# EAGLE design TurbochargerController IR (EAGLE 9.6.2)
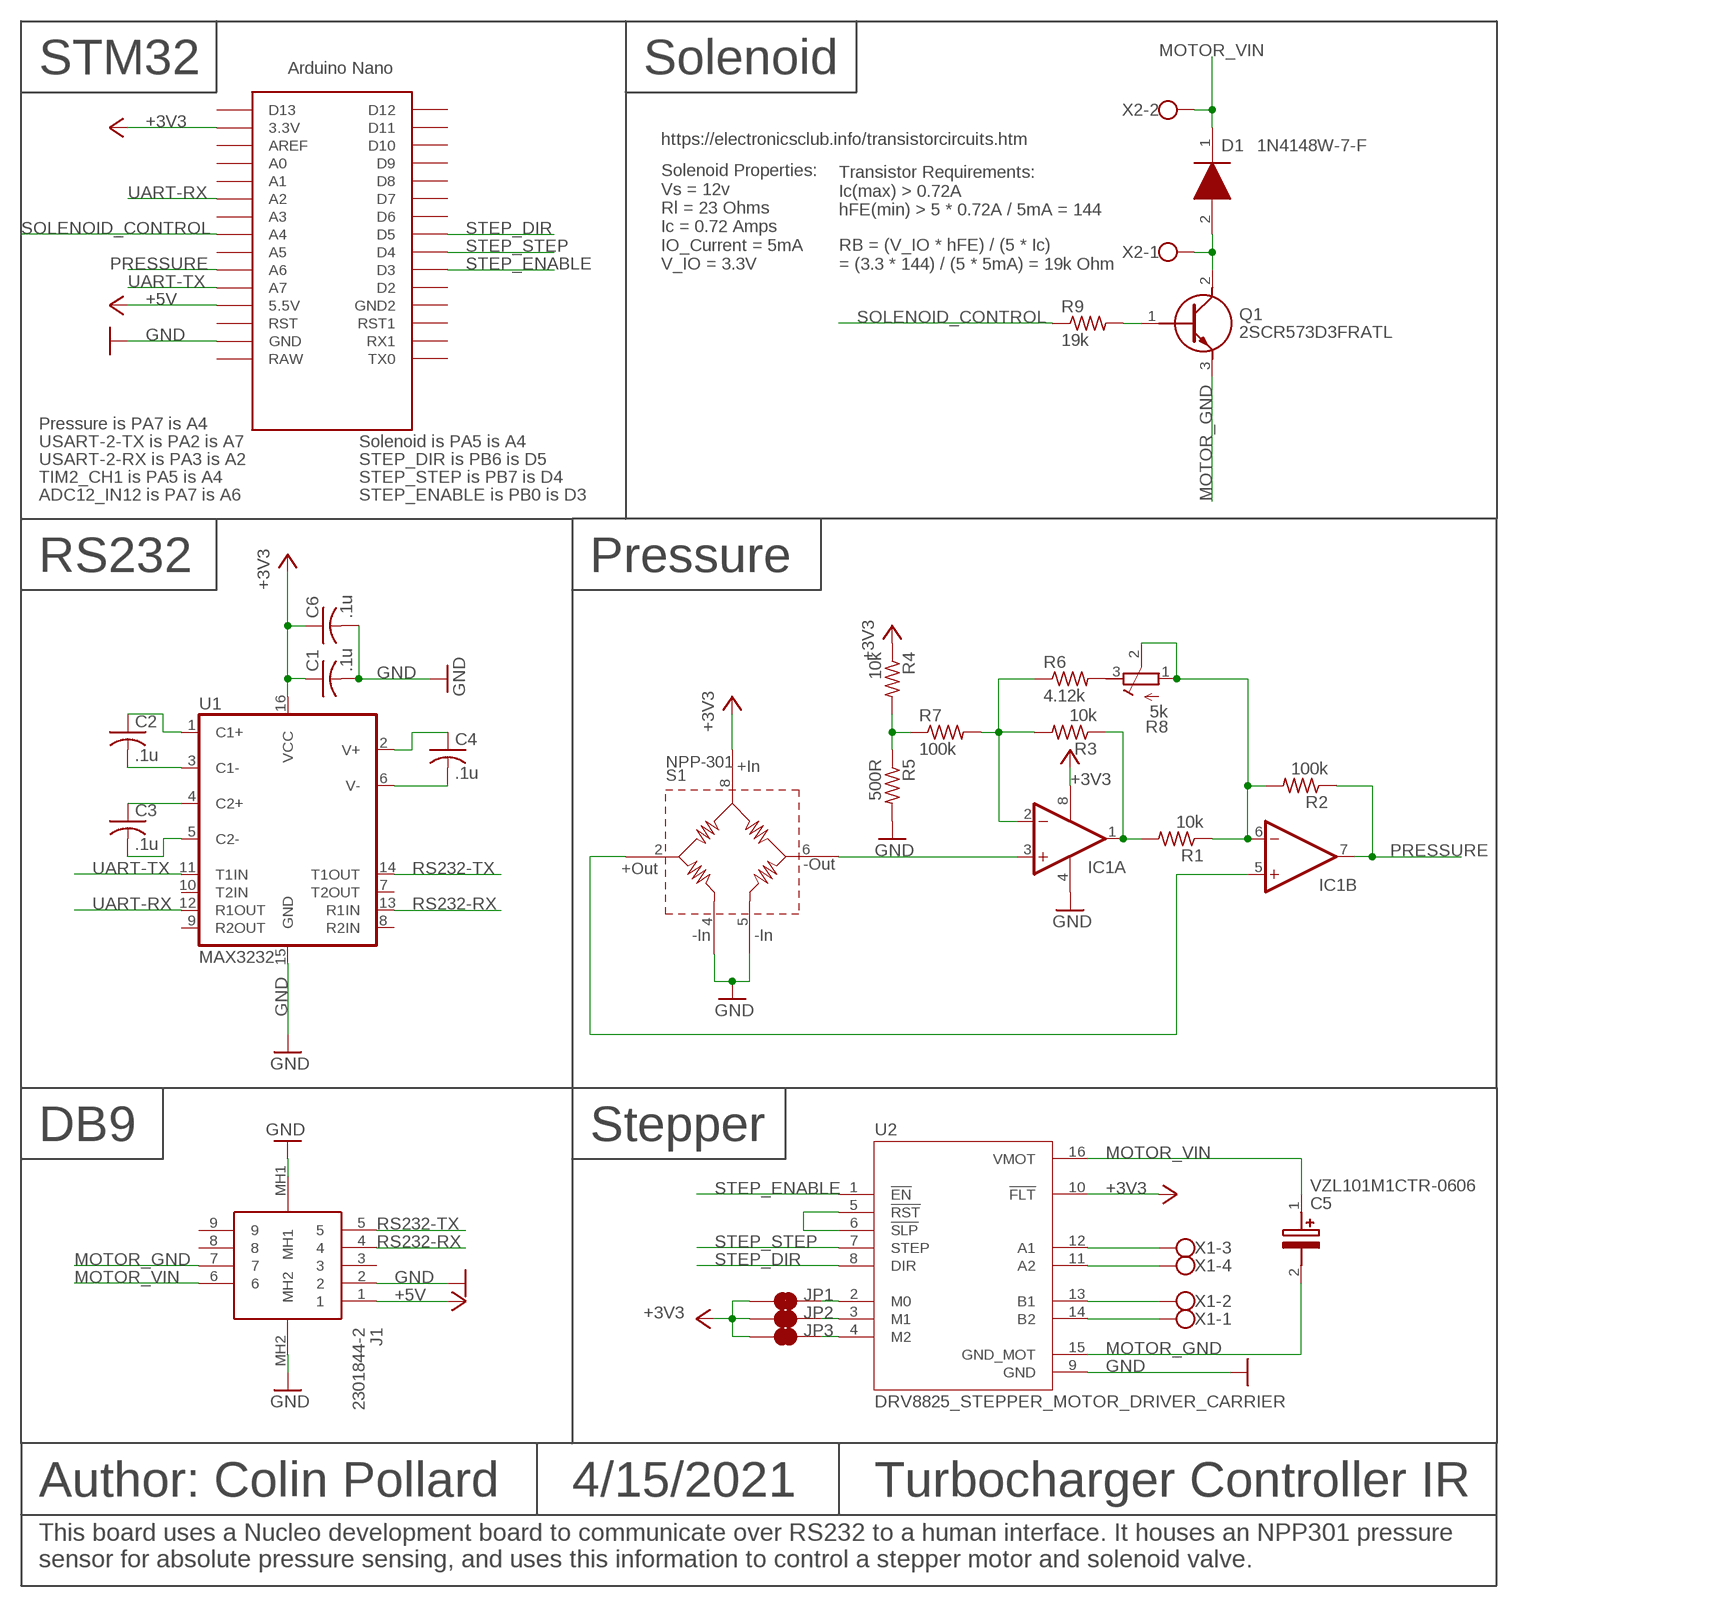
[diagram p0: schematic, sheet 1]

## Parts
C1  .1u  C-USC1206  [C1206]
C2  .1u  C-USC1206  [C1206]
C3  .1u  C-USC1206  [C1206]
C4  .1u  C-USC1206  [C1206]
C5  VZL101M1CTR-0606  [CAPAE660X610N]
C6  .1u  C-USC1206  [C1206]
D1  1N4148W-7-F  [SOD3716X145N]
IC1  TL072D  [SO08]
J1  2301844-2  [23018442]
JP1  JUMPER-SMT_2_NC_TRACE_SILK  [SMT-JUMPER_2_NC_TRACE_SILK]
JP2  JUMPER-SMT_2_NC_TRACE_SILK  [SMT-JUMPER_2_NC_TRACE_SILK]
JP3  JUMPER-SMT_2_NC_TRACE_SILK  [SMT-JUMPER_2_NC_TRACE_SILK]
Q1  2SCR573D3FRATL  [2SCR573D3FRATL]
R1  10k  R-US_R1206  [R1206]
R2  100k  R-US_R1206  [R1206]
R3  10k  R-US_R1206  [R1206]
R4  10k  R-US_R1206  [R1206]
R5  500R  R-US_R1206  [R1206]
R6  4.12k  R-US_R1206  [R1206]
R7  100k  R-US_R1206  [R1206]
R8  5k  R-TRIMM3296W  [RTRIM3296W]
R9  19k  R-US_R1206  [R1206]
S1  NPP-301  [SO08]
U1  MAX3232  MAX2323SOIC16  [SO16]
U2  DRV8825_STEPPER_MOTOR_DRIVER_CARRIER  [IC_DRV8825_STEPPER_MOTOR_DRIVER_CARRIER]
U$1  NANO  [NANO]
X1  W237-4  [W237-4]
X2  W237-102  [W237-102]

## Nets
+3V3: C1.1 C6.1 IC1.8(P:V+) JP1.1 JP2.1 JP3.1 R4.1 S1.8(+IN) U1.16(VCC) U2.10(!FLT) U$1.3.3V
+5V: J1.1 U$1.5V(5.5V)
GND: C1.2 C6.2 IC1.4(P:V-) J1.2 J1.MH1 J1.MH2 R5.2 S1.4(-IN_1) S1.5(-IN_2) U1.15(GND) U2.9(GND) U$1.GND
MOTOR_GND: C5.2(-) J1.7 Q1.3(E) U2.15(GND_MOT)
MOTOR_VIN: C5.1(+) D1.1(K) J1.6 U2.16(VMOT) X2.2
N$1: C3.1 U1.4(C2+)
N$2: C3.2 U1.5(C2-)
N$3: C2.1 U1.1(C1+)
N$4: C2.2 U1.3(C1-)
N$5: C4.2 U1.6(V-)
N$6: C4.1 U1.2(V+)
N$7: IC1.5(B:+IN) S1.2(+OUT)
N$8: IC1.1(A:OUT) R1.2 R3.1
N$9: U2.12(A1) X1.3
N$11: IC1.2(A:-IN) R3.2 R6.1 R7.2
N$12: IC1.3(A:+IN) S1.6(-OUT)
N$13: R6.2 R8.3(E)
N$14: IC1.6(B:-IN) R1.1 R2.2 R8.1(A) R8.2(S)
N$15: R4.2 R5.1 R7.1
N$16: U2.11(A2) X1.4
N$17: U2.13(B1) X1.2
N$18: U2.14(B2) X1.1
N$19: U2.5(!RST) U2.6(!SLP)
N$20: Q1.1(B) R9.2
N$21: D1.2(A) Q1.2(C) X2.1
N$22: JP3.2 U2.4(M2)
N$23: JP2.2 U2.3(M1)
N$24: JP1.2 U2.2(M0)
PRESSURE: IC1.7(B:OUT) R2.1 U$1.A6
RS232-RX: J1.4 U1.13(R1IN)
RS232-TX: J1.5 U1.14(T1OUT)
SOLENOID_CONTROL: R9.1 U$1.A4
STEP_DIR: U2.8(DIR) U$1.D5
STEP_ENABLE: U2.1(!EN) U$1.D3
STEP_STEP: U2.7(STEP) U$1.D4
UART-RX: U1.12(R1OUT) U$1.A2
UART-TX: U1.11(T1IN) U$1.A7
Unconnected: J1.3 J1.8 J1.9 U1.7(T2OUT) U1.8(R2IN) U1.9(R2OUT) U1.10(T2IN) U$1.A0 U$1.A1 U$1.A3 U$1.A5 U$1.AREF U$1.D2 U$1.D6 U$1.D7 U$1.D8 U$1.D9 U$1.D10 U$1.D11 U$1.D12 U$1.D13 U$1.GND1(GND2) U$1.ICSP1 U$1.ICSP2 U$1.ICSP3 U$1.ICSP4 U$1.ICSP5 U$1.ICSP6 U$1.RAW U$1.RST U$1.RST1 U$1.RX1 U$1.TX0

## Notes on the sheet
- STM32 | Solenoid
- https://electronicsclub.info/transistorcircuits.htm
- Transistor Requirements:
  Ic(max) > 0.72A
  hFE(min) > 5 * 0.72A / 5mA = 144
- Solenoid Properties:
  Vs = 12v
  Rl = 23 Ohms
  Ic = 0.72 Amps
  IO_Current = 5mA
  V_IO = 3.3V
- RB = (V_IO * hFE) / (5 * Ic) 
  = (3.3 * 144) / (5 * 5mA) = 19k Ohm
- Pressure is PA7 is A4
- USART-2-TX is PA2 is A7 | Solenoid is PA5 is A4
- USART-2-RX is PA3 is A2 | STEP_DIR is PB6 is D5
- TIM2_CH1 is PA5 is A4 | STEP_STEP is PB7 is D4
- ADC12_IN12 is PA7 is A6 | STEP_ENABLE is PB0 is D3
- RS232 | Pressure
- DB9 | Stepper
- Author: Colin Pollard | 4/15/2021 | Turbocharger Controller IR
- This board uses a Nucleo development board to communicate over RS232 to a human interface. It houses an NPP301 pressure 
  sensor for absolute pressure sensing, and uses this information to control a stepper motor and solenoid valve.

## Library data of the parts
C1-C4 C6 = rcl:C-US: CAPACITOR, American symbol; SPICEPREFIX: C
C5 = SamacSys_Parts:VZL101M1CTR-0606: Aluminum Electrolytic Capacitors - SMD 100uF 16 Volts 20% Source: Datasheet; DESCRIPTION: Aluminum Electrolytic Capacitors - SMD 100uF 16 Volts 20%; HEIGHT: 6.1mm; MANUFACTURER_NAME: Lelon; MANUFACTURER_PART_NUMBER: VZL101M1CTR-0606; MOUSER_PART_NUMBER: 140-VZL101M1CTR-0606; MOUSER_PRICE-STOCK: https://www.mouser.co.uk/ProductDetail/Lelon/VZL101M1CTR-0606?qs=AQlKX63v8RtJERxnS%252BVhgg%3D%3D
D1 = SamacSys_Parts:1N4148W-7-F: Diode Switching 150mA 100V 400mW SOD123 Diodes Inc 1N4148W-7-F Switching Diode 100V, 2-Pin SOD-123 Source: Datasheet <https://componentsearchengine.com/Datasheets/2/1N4148W-7-F.pdf>; DESCRIPTION: Diode Switching 150mA 100V 400mW SOD123 Diodes Inc 1N4148W-7-F Switching Diode 100V, 2-Pin SOD-123; HEIGHT: 1.45mm; MANUFACTURER_NAME: Diodes Inc.; MANUFACTURER_PART_NUMBER: 1N4148W-7-F; MOUSER_PART_NUMBER: 621-1N4148W-F; MOUSER_PRICE-STOCK: https://www.mouser.co.uk/ProductDetail/Diodes-Incorporated/1N4148W-7-F/?qs=LHX0FizJzg7Ae9ZM8LTAWw%3D%3D
IC1 = linear:TL072: OP AMP
J1 = SamacSys_Parts:2301844-2: TE CONNECTIVITY - 2301844-2 - D-SUB CONN, RCPT, 9POS, THROUGH HOLE Source: Datasheet <https://www.te.com/commerce/DocumentDelivery/DDEController?Action=showdoc&DocId=Customer Drawing2301844HpdfEnglishENG_CD_2301844_H.pdf2301844-2>; DESCRIPTION: TE CONNECTIVITY - 2301844-2 - D-SUB CONN, RCPT, 9POS, THROUGH HOLE; HEIGHT: 13.955mm; MANUFACTURER_NAME: TE Connectivity; MANUFACTURER_PART_NUMBER: 2301844-2; MOUSER_PART_NUMBER: 571-2301844-2; MOUSER_PRICE-STOCK: https://www.mouser.co.uk/ProductDetail/TE-Connectivity/2301844-2?qs=qSfuJ%252Bfl%2Fd438cnhtfFtiA%3D%3D
JP1-JP3 = SparkFun-Jumpers:JUMPER-SMT_2_NC_TRACE: Normally closed trace jumper This jumper has a trace between two pads so it's normally closed (NC). Use a razor knife to open the connection. For best results follow the IPC guidelines for cutting traces: Cutout at least 0.063 mm (0.005 in). Remove all loose material to clean up the cut area. Seal the cut with an approved epoxy. Reapply solder to reclose the connection.
Q1 = SamacSys_Parts:2SCR573D3FRATL: Bipolar Transistors - BJT NPN 50V 3A 10W TO-252(DPAK) Source: Datasheet <https://componentsearchengine.com/Datasheets/2/2SCR573D3FRATL.pdf>; DESCRIPTION: Bipolar Transistors - BJT NPN 50V 3A 10W TO-252(DPAK); HEIGHT: 2.3mm; MANUFACTURER_NAME: ROHM Semiconductor; MANUFACTURER_PART_NUMBER: 2SCR573D3FRATL; MOUSER_PART_NUMBER: 755-2SCR573D3FRATL; MOUSER_PRICE-STOCK: https://www.mouser.co.uk/ProductDetail/ROHM-Semiconductor/2SCR573D3FRATL?qs=qSfuJ%252Bfl%2Fd7Zix33eyvwHw%3D%3D
R1-R7 R9 = rcl:R-US_: RESISTOR, American symbol; SPICEPREFIX: R
R8 = rcl:R-TRIMM: Trimm resistor; SPICEMODEL: X; SPICEPREFIXL: POT
S1 = NPP-301:NPP-301
U1 = SparkFun-IC-Comms:MAX2323: RS232 Transceiver This part covers 232 drivers that are compatible with the MAX3232. Sipex SP3232EB Datasheet <http://cdn.sparkfun.com/datasheets/Components/General%20IC/SP3232EBCA-L.pdf> SparkFun Products SOIC component <https://www.sparkfun.com/products/589> (COM-00589 / IC-08171) Retired DIP component (COM-00316 / IC-08446) SparkFun Transceiver Breakout - MAX3232 <https://www.sparkfun.com/products/11189> (BOB-11189) SparkFun XBee Explorer Serial <https://www.sparkfun.com/products/13225> (WRL-13225); PROD_ID: IC-08171
U2 = DRV8825_STEPPER_MOTOR_DRIVER_CARRIER:DRV8825_STEPPER_MOTOR_DRIVER_CARRIER: Stepper motor controler; IC: DRV8825; 1.5A; Uin mot: 8.2÷45V; AVAILABILITY: Unavailable; DESCRIPTION: Stepper, Bipolar 8.2 ~ 45VDC Supply 1.5A 8.2 ~ 45V Load; MF: Pololu; MP: DRV8825 STEPPER MOTOR DRIVER CARRIER; PACKAGE: None; PRICE: None
U$1 = Arduino-clone:NANO: Arduino Nano
X1 = con-wago-500:W237-4: WAGO SCREW CLAMP; OC_FARNELL: unknown; OC_NEWARK: unknown
X2 = con-wago-500:W237-102: WAGO SCREW CLAMP; MPN: 237-102; OC_FARNELL: unknown; OC_NEWARK: 70K9898

## Board
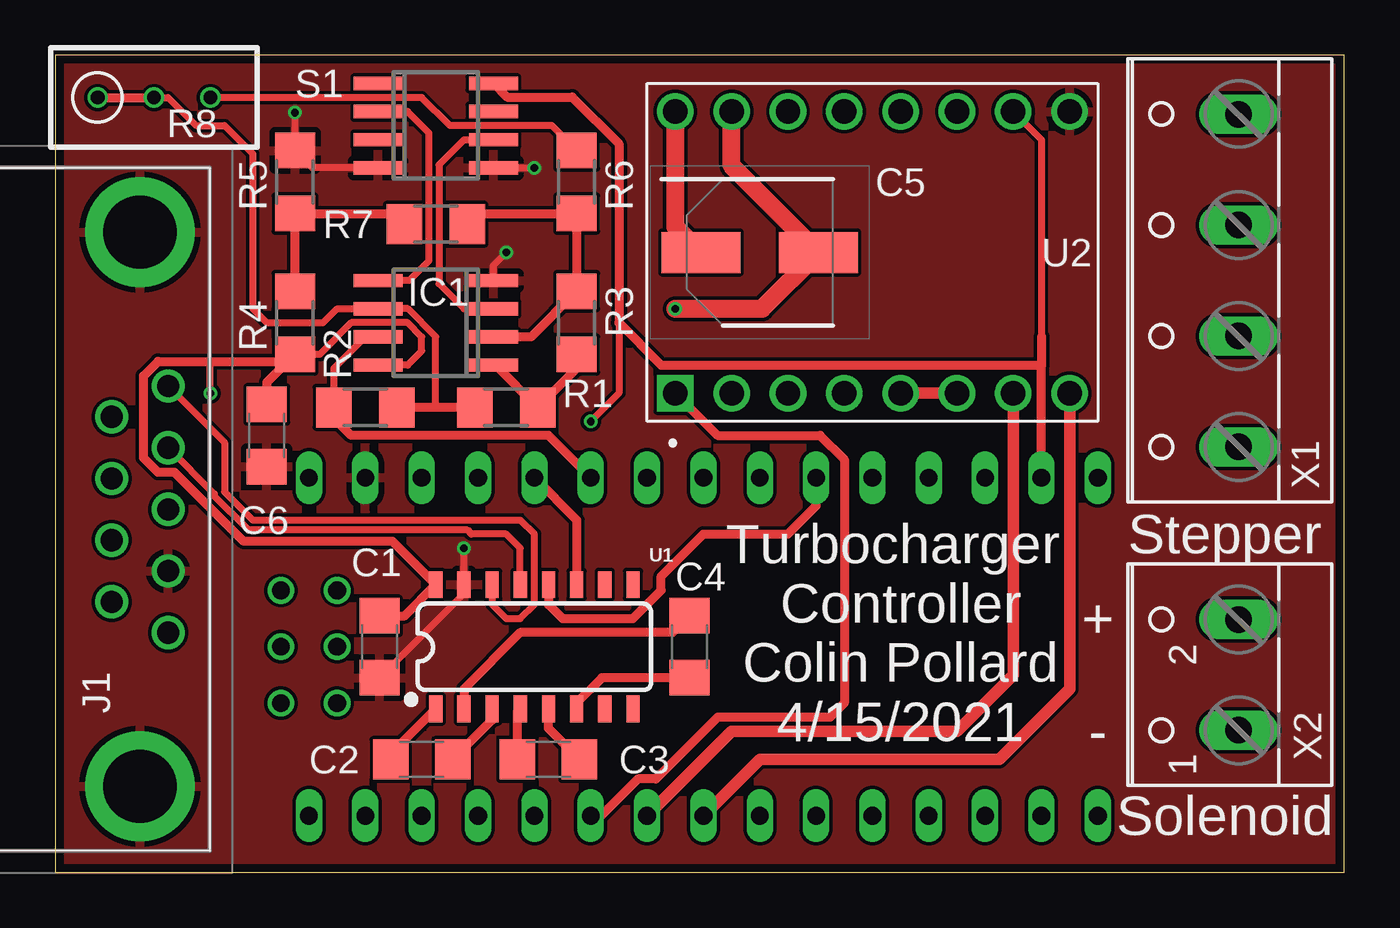
[diagram p1: board, top side]
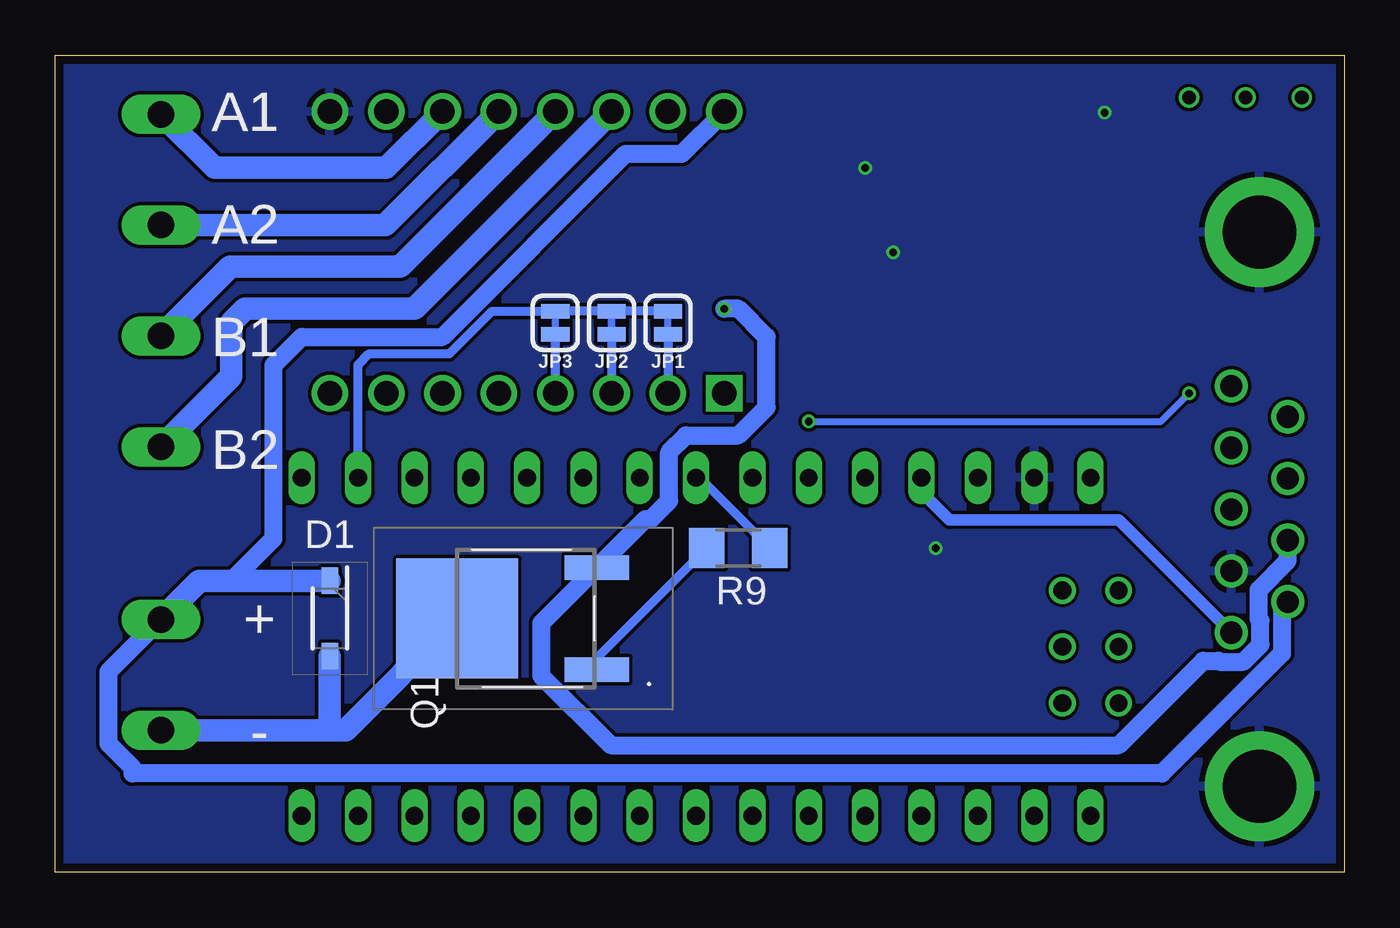
[diagram p2: board, bottom side, seen from below]

Size 58.09 x 36.82 mm. Coordinates in mm from the lower left corner, seen from the top.
Outline: 0,0 58.09,0 58.09,36.82 0,36.82 0,0
Copper layers (1*16): Top 0.035559375mm / dielectric 1.6mm / Bottom 0.035559375mm
Design rules "OSH DRC": minimum track width 6mil, minimum drill 10mil, track to track 6mil, track to pad 6mil, pad to pad 6mil, via to via 6mil, smd to smd 6mil, copper to edge 15mil, drill to drill 6mil, minimum pad ring 5mil, minimum via ring 5mil, stop-mask expansion 2.5mil, vias tented up to drill 0mil, thermal gap 10mil

### Footprints (pad centres in the part's own frame; a part is rotated, then mirrored left to right if it is on the bottom)
C1206 = smd 1.6 x 1.8: 1 -1.4,0; 2 1.4,0
CAPAE660X610N = smd 3.55 x 1.85: 1 -2.65,0; 2 2.65,0
SOD3716X145N = smd 1.2 x 0.75: 1 -1.7,0; 2 1.7,0
SO08 = smd 0.6 x 2.2: 1 -1.905,-2.6; 2 -0.635,-2.6; 3 0.635,-2.6; 4 1.905,-2.6; 5 1.905,2.6; 6 0.635,2.6; 7 -0.635,2.6; 8 -1.905,2.6
23018442 = drill 1 pad 1.5: 1 0,0; 2 -2.78,0; 3 -5.56,0; 4 -8.34,0; 5 -11.12,0; 6 -1.39,-2.54; 7 -4.17,-2.54; 8 -6.95,-2.54; 9 -9.73,-2.54 | drill 3.3 pad 4.95: MH1 -18.055,-1.27; MH2 6.935,-1.27
SMT-JUMPER_2_NC_TRACE_SILK = smd 0.66 x 1.27: 1 -0.521,0; 2 0.521,0
2SCR573D3FRATL = smd 1.1 x 2.9: 1 -2.3,-3.15; 3 2.3,-3.15 | smd 5.4 x 5.5: 2 0,3.15
R1206 = smd 1.6 x 1.803: 1 -1.422,0; 2 1.422,0
RTRIM3296W = drill 0.61: 1 0,-2.54; 2 0,0; 3 0,2.54
SO16 = smd 0.6 x 1.2: 1 -4.445,-2.8; 2 -3.175,-2.8; 3 -1.905,-2.8; 4 -0.635,-2.8; 5 0.635,-2.8; 6 1.905,-2.8; 7 3.175,-2.8; 8 4.445,-2.8; 9 4.445,2.8; 10 3.175,2.8; 11 1.905,2.8; 12 0.635,2.8; 13 -0.635,2.8; 14 -1.905,2.8; 15 -3.175,2.8; 16 -4.445,2.8
IC_DRV8825_STEPPER_MOTOR_DRIVER_CARRIER = drill 1.1 square: 1 -6.35,8.89 | drill 1.1: 2 -6.35,6.35; 3 -6.35,3.81; 4 -6.35,1.27; 5 -6.35,-1.27; 6 -6.35,-3.81; 7 -6.35,-6.35; 8 -6.35,-8.89; 9 6.35,-8.89; 10 6.35,-6.35; 11 6.35,-3.81; 12 6.35,-1.27; 13 6.35,1.27; 14 6.35,3.81; 15 6.35,6.35; 16 6.35,8.89
NANO = drill 0.8 long: 3.3V -10.16,24.13; 5V -10.16,-1.27; A0 -10.16,19.05; A1 -10.16,16.51; A2 -10.16,13.97; A3 -10.16,11.43; A4 -10.16,8.89; A5 -10.16,6.35; A6 -10.16,3.81; A7 -10.16,1.27; AREF -10.16,21.59; D2 5.08,1.27; D3 5.08,3.81; D4 5.08,6.35; D5 5.08,8.89; D6 5.08,11.43; D7 5.08,13.97; D8 5.08,16.51; D9 5.08,19.05; D10 5.08,21.59; D11 5.08,24.13; D12 5.08,26.67; D13 -10.16,26.67; GND -10.16,-6.35; GND1 5.08,-1.27; RAW -10.16,-8.89; RST -10.16,-3.81; RST1 5.08,-3.81; RX1 5.08,-6.35; TX0 5.08,-8.89 | drill 0.8: ICSP1 -5.08,-10.16; ICSP2 -5.08,-7.62; ICSP3 -2.54,-10.16; ICSP4 -2.54,-7.62; ICSP5 0,-10.16; ICSP6 0,-7.62
W237-4 = drill 1.194 long: 1 -7.5,-1.27; 2 -2.5,-1.27; 3 2.5,-1.27; 4 7.5,-1.27
W237-102 = drill 1.194 long: 1 -2.5,-1.27; 2 2.5,-1.27

### Placement (x,y rotation side)
C1  14.61,10.16 270 top
C2  16.51,5.08 0 top
C3  22.23,5.08 0 top
C4  28.57,10.16 270 top
C5  31.75,27.94 0 top
C6  9.53,19.68 270 top
D1  45.72,11.43 270 bottom
IC1  17.14,24.77 90 top
J1  5.08,10.79 270 top
JP1  30.48,24.77 270 bottom
JP2  33.02,24.77 270 bottom
JP3  35.56,24.77 270 bottom
Q1  36.83,11.43 90 bottom
R1  20.32,20.95 0 top
R2  13.97,20.95 0 top
R3  23.5,24.77 90 top
R4  10.79,24.77 90 top
R5  10.79,31.11 90 top
R6  23.5,31.11 90 top
R7  17.14,29.21 0 top
R8  4.45,34.92 270 top
R9  27.3,14.61 180 bottom
S1  17.14,33.66 270 top
U1  21.59,10.16 0 top
U2  36.83,27.94 90 top
U$1  20.32,7.62 270 top
X1  52.07,26.67 90 top
X2  52.07,8.89 90 top

### Tracks (layer width: path | path; a pad name or v marks a point on that pad's centre or on a via)
+3V3  (via drill 0.35)
  Top 0.305: R4.1 11.91,23.34 13.34,24.77 15.88,24.77 16.51,24.13 16.51,23.5 15.88,22.86 IC1.8 | U2.10 44.45,33.02 44.45,24.13 | 25.4,24.77 25.4,21.59 v24.13,20.32 | v6.99,21.59 6.99,23.02
  Top 0.406: U$1.3.3V 44.45,22.86 | 44.45,24.13 44.45,22.86 | C1.1 15.74,11.56 U1.16 15.2,14.91 8.49,14.91 5.38,18.02 4.62,18.02 3.97,18.68 3.97,22.38 4.62,23.02 6.99,23.02 10.48,23.02 R4.1 9.53,22.07 C6.1 | S1.8 20.36,34.95 23.29,34.95 25.4,32.84 25.4,24.77 27.3,22.86 44.45,22.86
  Bottom 0.305: v24.13,20.32 8.26,20.32 v6.99,21.59
  Bottom 0.406: JP1.1 JP2.1 JP3.1 38.41,25.29 40.32,23.37 43.94,23.37 44.45,22.86 U$1.3.3V
+5V
  Bottom 0.508: J1.1 10.16,15.88 17.78,15.88 19.05,17.14 U$1.5V
GND  (via drill 0.35)
  Top 0.305: S1.4 11.58,31.75 R5.2 v10.79,34.24 | S1.5 v21.59,31.75 | IC1.4 19.75,27.36 v20.32,27.94 | C1.2 18.41,12.57 U1.15 v18.41,14.61
  pour Top: 0,36.83 57.78,36.83 57.78,0 0,0
  pour Bottom: 0,36.83 57.78,36.83 57.78,0 0,0
MOTOR_GND  (via drill 0.35)
  Top 0.813: U2.15 30.48,31.86 C5.2 31.86,25.4 v27.94,25.4
  Bottom 0.813: J1.7 2.54,14.04 3.85,12.73 3.85,11.42 3.77,11.34 3.77,10.25 4.54,9.48 5.62,9.48 5.67,9.53 6.35,9.53 10.16,5.71 33.05,5.71 36.2,8.86 36.2,11.21 Q1.3 31.5,15.91 31.25,15.91 30.42,16.74 30.42,18.94 29.67,19.68 27.3,19.68 26.04,20.95 26.04,24.13 27.3,25.4 v27.94,25.4
MOTOR_VIN
  Top 0.813: U2.16 27.94,29.1 C5.1
  Bottom 0.813: 50.16,13.13 48.26,15.04 48.26,22.86 46.99,24.13 40.64,24.13 32.38,32.38 29.84,32.38 U2.16 | X2.2 55.69,9.04 55.69,5.79 54.61,4.71 54.61,4.45 8.21,4.45 2.8,9.85 2.8,11.92 J1.6
  Bottom 1.016: D1.1 50.16,13.13 51.6,13.13 X2.2
N$1
  Top 0.406: C3.1 20.82,7.23 U1.4
N$2
  Top 0.406: C3.2 22.23,6.48 U1.5
N$3
  Top 0.406: U1.1 15.11,5.33 C2.1
N$4
  Top 0.406: C2.2 19.68,6.86 U1.3
N$5
  Top 0.406: C4.2 24.64,8.76 23.5,7.62 U1.6
N$6
  Top 0.406: C4.1 27.81,10.79 20.95,10.79 18.41,8.26 U1.2
N$7
  Top 0.305: S1.2 15.88,34.29 16.83,33.34 16.83,27.55 15.95,26.67 IC1.5
N$8
  Top 0.406: IC1.1 19.84,22.86 R1.2 23.5,22.71 R3.1
N$9
  Bottom 1.016: X1.3 43.22,29.17 U2.12
N$11
  Top 0.406: IC1.2 21.44,24.13 R3.2 R6.1 19.05,29.69 R7.2
N$12
  Top 0.305: S1.6 18.41,33.02 17.29,31.89 17.29,26.53 18.41,25.4 IC1.3
N$13
  Top 0.305: R6.2 22.38,33.66 17.78,33.66 16.51,34.92 R8.3
N$14
  Top 0.305: R8.2 5.08,34.92 6.35,33.66 7.62,33.66 8.89,32.38 8.89,25.4 9.53,24.77 12.06,24.77 12.7,25.4 IC1.6 15.89,25.4 17.14,24.14 17.14,20.95
  Top 0.406: R1.1 17.14,20.95 R2.2 | R8.1 R8.2
N$15
  Top 0.406: R4.2 R5.1 15.24,29.69 R7.1
N$16
  Bottom 1.016: U2.11 43.18,31.75 50.92,31.75 X1.4
N$17
  Bottom 1.016: X1.2 50.2,27.3 42.55,27.3 U2.13
N$18
  Bottom 1.016: X1.1 50.16,22.34 50.16,24.77 49.53,25.4 41.91,25.4 U2.14
N$19
  Top 0.508: U2.6 U2.5
N$20
  Bottom 0.406: R9.2 33.68,9.65 Q1.1
N$21
  Bottom 1.016: Q1.2 45.02,6.39 45.72,6.39 | 45.72,6.39 X2.1 | D1.2 45.72,6.39
N$22
  Bottom 0.406: JP3.2 U2.4
N$23
  Bottom 0.406: JP2.2 U2.3
N$24
  Bottom 0.406: JP1.2 U2.2
PRESSURE
  Top 0.305: IC1.7 13.97,24.13 12.55,22.71 R2.1
  Top 0.406: U$1.A6 22.23,19.68 13.34,19.68 12.55,20.47 R2.1
RS232-RX
  Top 0.305: U1.13 20.95,14.61 20.32,15.24 18.75,15.24 18.57,15.42 8.7,15.42 7.16,16.96 7.16,17.05 J1.4
RS232-TX
  Top 0.305: U1.14 19.68,12.06 20.32,11.43 20.95,11.43 21.59,12.06 21.59,15.24 20.95,15.88 8.89,15.88 7.62,17.14 7.62,19.38 J1.5
SOLENOID_CONTROL
  Bottom 0.406: R9.1 29.06,17.78 U$1.A4
STEP_DIR
  Top 0.508: U$1.D5 31.75,5.08 42.55,5.08 45.72,8.26 U2.8
STEP_ENABLE
  Top 0.406: U2.1 29.84,19.68 34.47,19.68 35.56,18.59 35.56,7.62 34.92,6.99 29.84,6.99 27.06,4.2 26.25,4.2 24.59,2.54 U$1.D3
STEP_STEP
  Top 0.508: U$1.D4 30.48,6.35 40.64,6.35 43.18,8.89 U2.7
UART-RX
  Top 0.406: U1.12 22.23,12.06 22.86,11.43 26.04,11.43 27.3,12.7 27.3,13.34 29.21,15.24 33.02,15.24 34.29,16.51 U$1.A2
UART-TX
  Top 0.406: U$1.A7 23.5,15.88 U1.11

### Text on the board
tNames: Stepper | Turbocharger / Controller / Colin Pollard / 4/15/2021 | + | - | Solenoid
bNames: A1 | A2 | B1 | B2 | + | -
bStop: CMP